# Altium schematic sheet IH2500-UI_Panel_Cover.SchDoc: UI面板封面
size 297 x 210 mm; ENG_APP_DATE: --/--/--; DSN_APP_DATE: --/--/--; CHK_APP_DATE: --/--/--; Date: 2025/07/10; Author: Leon Lee; CompanyName: 华南理工大学; Organization: 华南理工大学; Address1: 五山路381号; Address2: 天河区，广州市; Address3: 广东省; DocumentNumber: IH2500-08-001; Revision: 1.0; SheetNumber: 2; SheetTotal: 2; Project: IH2500
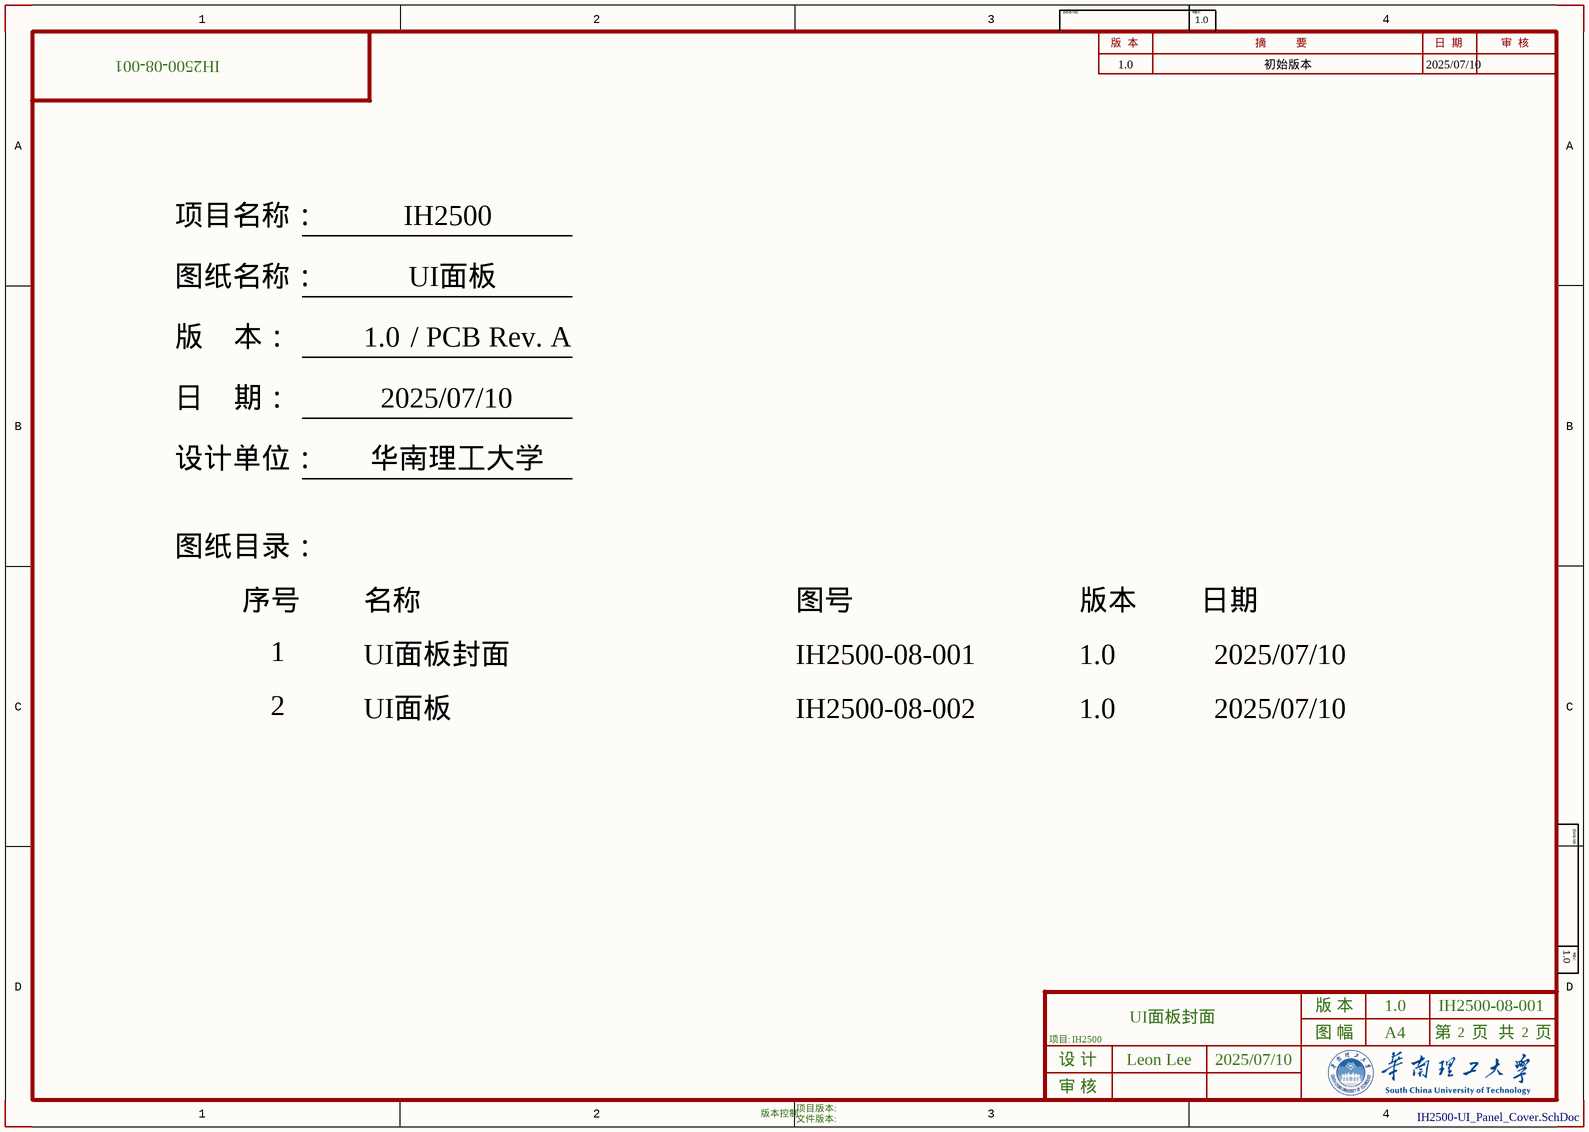
[diagram p0: IH2500-UI_Panel_Cover.SchDoc]

## Notes on the sheet
- 1.0
- 初始版本
- 2025/07/10
- 项目名称：
- 图纸名称：
- UI面板
- 版    本：
- / PCB Rev. A
- 日    期：
- 设计单位：
- 图纸目录：
- 序号
- 名称
- 图号
- 版本
- 日期
- 1
- IH2500-08-001
- 2
- IH2500-08-002
- DWG NO:
- 版  本
- REV:
- 摘          要
- 日  期
- 审  核
- 版 本
- 项目:
- 设 计
- 审 核
- 图 幅
- A4
- 第
- 页
- 共
- 版本控制
- 项目版本:
- 文件版本: